# Altium project ESP32_Dev_Board.PrjPcb
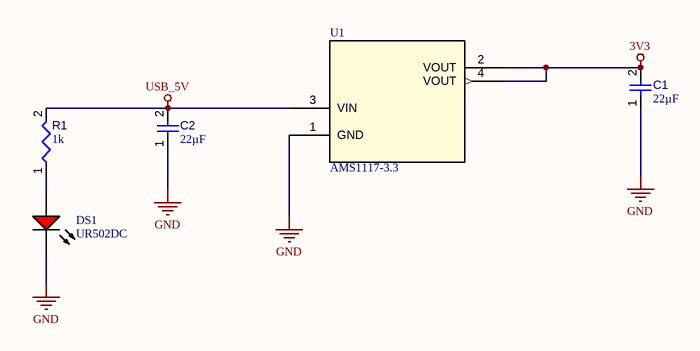
[diagram p0: 5V-to-3.3V_Voltage _Regulator.SchDoc]
4 sheets, 34 parts. Net scope: global (net labels, ports and power ports of the same name join across sheets).
Board file: ESP32_Dev_Board.PcbDoc
Sheets:
  5V-to-3.3V_Voltage _Regulator.SchDoc
  Micro_USB_&_USB-UART.SchDoc
  Connectors_&_Switch_Buttons.SchDoc
  ESP32_Module.SchDoc

## Sheet 5V-to-3.3V_Voltage _Regulator.SchDoc
size 431 x 279 mm; Organization: ORGANIZATION; Address1: ADDRESS 1; Address2: ADDRESS 2; Address3: ADDRESS 3; Address4: ADDRESS 4; Revision: -; SheetNumber: 1; SheetTotal: 4; ENG_APP_DATE: --/--/--; DSN_APP_DATE: --/--/--; CHK_APP_DATE: --/--/--

### Parts
C1  value 22µF  [CAPC0805(2012)145_L]  (hidden comment: Capacitor 22µF +/-40% 16V 0805)
C2  value 22µF  [CAPC0805(2012)145_L]  (hidden comment: Capacitor 22µF +/-40% 16V 0805)
DS1  UR502DC  [CGX-UR502DC]
R1  value 1k  [RESC0805(2012)_L]  (hidden comment: Resistor 1K +/-5% 0805 125 mW)
U1  AMS1117-3.3  [SOT-223_UMW]

### Nets
3V3: C1.2 U1.2(VOUT) U1.4(VOUT)
GND: C1.1 C2.1 DS1.2(K) U1.1(GND)
USB_5V: C2.2 R1.2 U1.3(VIN)
NetDS1_1: DS1.1(A) R1.1

### Notes on the sheet
- DWG. NO.
- REV.
- SHT.
- THIS DOCUMENT AND THE DATA DISCLOSED HEREIN OR HEREWITH IS THE PROPERTY OF ALTIUM LIMITED AND MAY BE FREELY DISTRIBUTED IN WHOLE. NO RIGHTS ARE RESERVED OR EXPRESS OR IMPLIED WARANTEE GIVEN.
- REVISION
- DESCRIPTION
- DATE
- APPROVED
- ENG:
- DSN:
- APPROVALS
- PROJECT REVISION:
- www.altium.com <http://www.altium.com>
- DOCUMENT REVISION:
- 92037, La Jolla
- USA
- Altium Ltd.
- 4225 Executive Square
- CHK:
- REFERENCE DOCUMENTS
- DESIGN ITEM:
- TITLE
- VARIANT
- BOM:
- FAB DWG:
- PCB DWG:
- ASSY DWG:
- SCALE:
- SIZE
- B
- CAGE CODE
- FILE NAME
- DWG NO.
- SHEET
- OF
- REV

### Library data of the parts
C1 C2 = CMP-001-00081-4: Chip Capacitor, 22µF +/-40%, 16V, 0805, Thickness 1.45 mm; Tolerance: 5%; Voltage Rating: 16V; Mounting Technology: SMT; Pins: 2; Max Operating Temperature: 85°C; Case/Package: 0805; Min Operating Temperature: -55°C
DS1 = CMP-007-00009-2: Red LED, 80 mW, 30 mA, -25 to 85 degC, 2-Pin THD; Manufacturer: Shenzhen CGX; Power: 80mW; Case/Package: UR502DC; RoHS Compliant: Unknown; Package Description: 2-Pin Through Hole Device, Dia 5.9 mm, Height 9.1 mm; Manufacturer URL: http://szcgx.com/; Datasheet Version: Sep-14; Package Reference: UR502DC; Datasheet URL: http://datasheet.octopart.com/UR502DC-Chengguangxing-datasheet-62330342.pdf; Mounting Technology: TH
R1 = CMP-009-00118-3: Chip Resistor, 1 kOhms, +/-5%, 125 mW, -55 to 155 degC, 0805; Tolerance: 5%; Power: 125mW; Case/Package: 0805; Pins: 2; Min Operating Temperature: -55°C; Max Operating Temperature: 155°C
U1 = AMS1117-3.3: Description; Manufacturer_Name: UMW(Youtai Semiconductor Co., Ltd.); Copyright: Copyright (C) 2026 Ultra Librarian. All rights reserved.; Manufacturer_Part_Number: AMS1117-3.3; RefDes: RefDes; Type: Type

## Sheet Micro_USB_&_USB-UART.SchDoc
size 431 x 279 mm; Organization: ORGANIZATION; Address1: ADDRESS 1; Address2: ADDRESS 2; Address3: ADDRESS 3; Address4: ADDRESS 4; Revision: -; SheetNumber: 2; SheetTotal: 4; ENG_APP_DATE: --/--/--; DSN_APP_DATE: --/--/--; CHK_APP_DATE: --/--/--
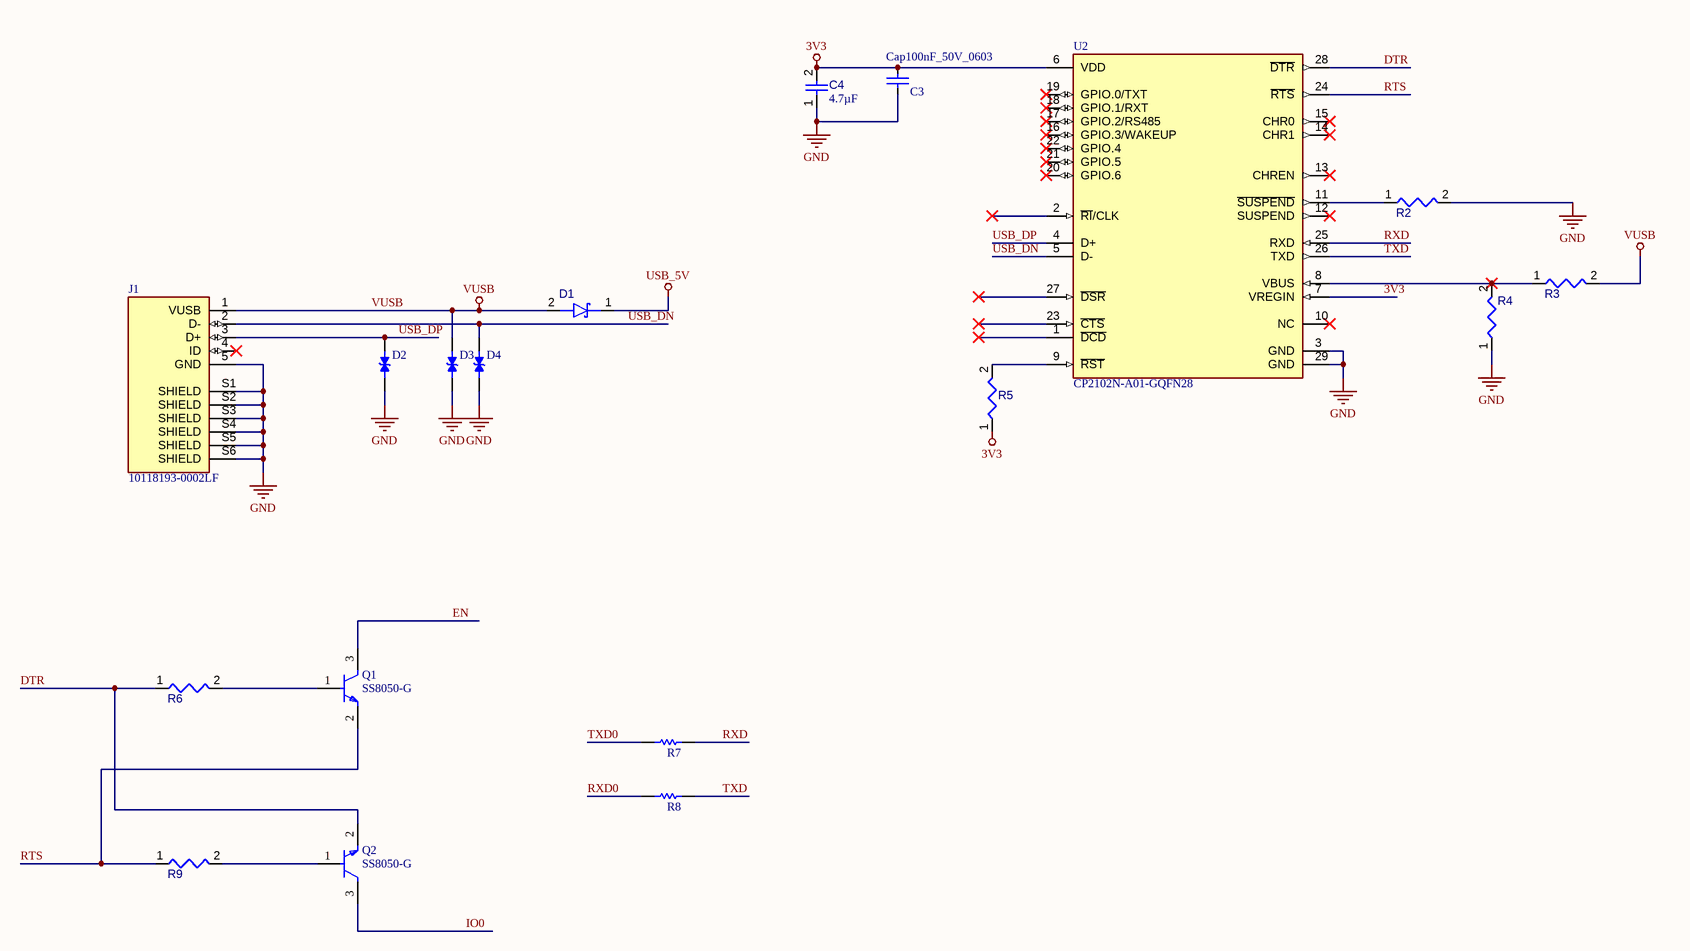
[diagram p1: Micro_USB_&_USB-UART.SchDoc]

### Parts
C3  Cap100nF_50V_0603  [0603C_L]
C4  value 4.7µF  [CAPC0805(2012)145_L]  (hidden comment: Capacitor 4.7µF +/-40% 25V 0805)
D1  RB520CM-30  [ROHM-VMN2-2_V]  (value not drawn)
D2  LESD5D5.0CT1G  [TVS_LESD5D5.0CT1G]  (value not drawn)
D3  LESD5D5.0CT1G  [TVS_LESD5D5.0CT1G]  (value not drawn)
D4  LESD5D5.0CT1G  [TVS_LESD5D5.0CT1G]  (value not drawn)
J1  10118193-0002LF  [AMPHENOL_10118193-0002LF]
Q1  SS8050-G  [FP-SS8050-G-MFG]
Q2  SS8050-G  [FP-SS8050-G-MFG]
R2  Resistor 10K  +/-1 % 0402 63 mW  [RESC0402(1005)_L]  (value not drawn)
R3  MFR-25FBF52-22K1  [RESA60-630X240]  (value not drawn)
R4  Resistor 47K5 +/-1 % 0402 63 mW  [RESC0402(1005)_L]  (value not drawn)
R5  Resistor 2K +/-5 % 0402 63 mW  [RESC0402(1005)_L]  (value not drawn)
R6  Resistor 10K  +/-1 % 0402 63 mW  [RESC0402(1005)_L]  (value not drawn)
R7  Resistor 0R +/- 5% 1206 250 mW  [RESC3216X60X45ML15T20]  (value not drawn)
R8  Resistor 0R +/- 5% 1206 250 mW  [RESC3216X60X45ML15T20]  (value not drawn)
R9  Resistor 10k +/-1% 0805 125 mW  [RESC2013X50X35ML15T15]  (value not drawn)
U2  CP2102N-A01-GQFN28  [FP-CP2102N-A01-GQFN28-MFG]

### Nets
3V3: C3.1 C4.2 R5.1 U2.6(VDD) U2.7(VREGIN)
GND: C3.2 C4.1 D2.1 D3.1 D4.1 J1.5(GND) J1.S1(SHIELD) J1.S2(SHIELD) J1.S3(SHIELD) J1.S4(SHIELD) J1.S5(SHIELD) J1.S6(SHIELD) R2.2 R4.1 U2.3(GND) U2.29(GND)
USB_5V: D1.1(K)
VUSB: D1.2(A) D3.2 J1.1(VUSB) R3.2
DTR: Q2.2(E) R6.1 U2.28(~{DTR})
EN: Q1.3(C)
IO0: Q2.3(C)
RTS: Q1.2(E) R9.1 U2.24(~{RTS})
RXD: R7.2 U2.25(RXD)
RXD0: R8.1
TXD: R8.2 U2.26(TXD)
TXD0: R7.1
USB_DN: D4.2 J1.2(D-) U2.5(D-)
USB_DP: D2.2 J1.3(D+) U2.4(D+)
NetQ1_1: Q1.1(B) R6.2
NetQ2_1: Q2.1(B) R9.2
NetR2_1: R2.1 U2.11(~{SUSPEND})
NetR3_1: R3.1 R4.2 U2.8(VBUS)
NetR5_2: R5.2 U2.9(~{RST})

Not connected (* = marked no-connect by the designer): J1 4(ID)*; U2 1(~{DCD})* 2(~{RI}/CLK)* 10(NC)* 12(SUSPEND)* 13(CHREN)* 14(CHR1)* 15(CHR0)* 16(GPIO.3/WAKEUP)* 17(GPIO.2/RS485)* 18(GPIO.1/RXT)* 19(GPIO.0/TXT)* 20(GPIO.6)* 21(GPIO.5)* 22(GPIO.4)* 23(~{CTS})* 27(~{DSR})*

### Notes on the sheet
- DWG. NO.
- REV.
- SHT.
- THIS DOCUMENT AND THE DATA DISCLOSED HEREIN OR HEREWITH IS THE PROPERTY OF ALTIUM LIMITED AND MAY BE FREELY DISTRIBUTED IN WHOLE. NO RIGHTS ARE RESERVED OR EXPRESS OR IMPLIED WARANTEE GIVEN.
- REVISION
- DESCRIPTION
- DATE
- APPROVED
- ENG:
- DSN:
- APPROVALS
- PROJECT REVISION:
- www.altium.com <http://www.altium.com>
- DOCUMENT REVISION:
- 92037, La Jolla
- USA
- Altium Ltd.
- 4225 Executive Square
- CHK:
- REFERENCE DOCUMENTS
- DESIGN ITEM:
- TITLE
- VARIANT
- BOM:
- FAB DWG:
- PCB DWG:
- ASSY DWG:
- SCALE:
- SIZE
- B
- CAGE CODE
- FILE NAME
- DWG NO.
- SHEET
- OF
- REV

### Library data of the parts
C3 = CMP-001-00084-1: Ceramic Capacitor, Multilayer, Ceramic, 50V, 80% +Tol, 20% -Tol, Y5V, -82/+22% TC, 0.1uF, Surface Mount, 0603; Manufacturer: Yageo; Manufacturer Part Number: CC0603ZRY5V9BB104; Value: 100nF; Multilayer: Yes; Mounting Technology: Surface Mount; Case/Package: 0603; Pins: 2; RoHS Compliant: Yes; Min Operating Temperature: -30°C; Max Operating Temperature: 85°C; Capacitor Type: Ceramic; Voltage Rating: 50V; Component Type: Capacitors; Source: WCT.SCHLIB; Design Item ID: Cap100nF_50V_0603; Tolerance (fill in as +-): 80%; Packaging: Tape and Reel; Termination: Wraparound; Height: 0.8mm; Reach SVHC Compliant: Yes; Rated DC Voltage (URdc): 50V; Package Style: SMTMeter; Tolerance  (fill in as +-): 20%; Length: 1.6mm; JESD-609 Code: e3; Terminal Finish: Nickel; Dielectric Material: Ceramic; Temperature Characteristics Code: Y5V; Package Shape: Rectangular; Width: 0.8mm
C4 = CMP-001-00080-4: Chip Capacitor, 4.7µF +/-40%, 25V, 0805, Thickness 1.45 mm; Tolerance: 20%; Voltage Rating: 25V; Min Operating Temperature: -55°C; Max Operating Temperature: 85°C; Pins: 2; Mounting Technology: SMT; Case/Package: 0805
D1 = CMP-004-00028-3: DIODE SCHOTTKY 30V 100MA VMN2M; Case/Package: SMD/SMT; Pins: 2; Mounting Technology: SMT
D2-D4 = LESD5D5.0CT1G: Transient Voltage Suppressors for ESD Protection; MF: Leshan Radio Co.; Check_prices: https://www.snapeda.com/parts/LESD5D5.0CT1G/Leshan+Radio+Co./view-part/?ref=eda; Value: *; Availability: Not in stock; Package: None; SnapEDA_Link: https://www.snapeda.com/parts/LESD5D5.0CT1G/Leshan+Radio+Co./view-part/?ref=snap; MP: LESD5D5.0CT1G; Price: None
J1 = 10118193-0002LF: Micro USB 2.0, Input Output Connectors, B TYPE RECEPTACLE with flange; MF: Amphenol ICC (FCI); SnapEDA_Link: https://www.snapeda.com/parts/10118193-0002LF/Amphenol+FCI/view-part/?ref=snap; Package: None; Value: *; MP: 10118193-0002LF; Check_prices: https://www.snapeda.com/parts/10118193-0002LF/Amphenol+FCI/view-part/?ref=eda
Q1 Q2 = CMP-20235-000001-1: NPN TRANSISTOR 1.5A 40V SOT-23 R; Transition Frequency: 100MHz; Max Breakdown Voltage: 25V; Collector Emitter Voltage (VCEO): 400mV; Max Power Dissipation: 300mW; Max Collector Current: 1.5A; Case/Package: TO-236-3; Packaging: Tape and Reel; RoHS Compliant: Yes; Mount: Surface Mount; Collector Emitter Breakdown Voltage: 25V
R2 = CMP-009-00149-3: Chip Resistor, 10 kOhms, +/-1 %, 63 mW, -55 to 125 degC, 0402; Tolerance: 1%; Power: 63mW; Case/Package: 0402; Pins: 2; Min Operating Temperature: -55°C; Max Operating Temperature: 155°C; Value: 10k
R3 = CMP-009-00052-4: Axial Resistor, 22.1 KOhm, +/- 1%, 0.25 W, -55 to 155 degC, 2-Pin THD, RoHS, Bulk; Manufacturer: Yageo; Power: 250mW; Voltage Rating: 250V; Value: 22.1k; Mounting Technology: TH; Case/Package: Axial; RoHS Compliant: True; Min Operating Temperature: -55°C; Max Operating Temperature: 155°C; Tolerance: 1%; Packaging: Bulk; Package Quantity: 200; Package Reference: MFR-25; Manufacturer URL: http://www.yageo.com/; Package Description: 2-Pin Axial Lead, Dia 2.4 mm, Body Length 6.3 mm; Datasheet Version: Apr-13; Datasheet URL: http://www.yageo.com/documents/recent/Yageo%20LR_MFR_2013.pdf
R4 = CMP-009-00137-3: Chip Resistor, 47,5 kOhms, +/-1 %, 63 mW, -55 to 155 degC, 0402; Tolerance: 1%; Power: 63mW; Value: 47.5k; Case/Package: 0402; Pins: 2; Min Operating Temperature: -55°C; Max Operating Temperature: 155°C
R5 = CMP-009-00138-3: Chip Resistor, 2 kOhms, +/-5 %, 63 mW, -55 to 155 degC, 0402; Tolerance: 5%; Power: 63mW; Case/Package: 0402; Pins: 2; Min Operating Temperature: -55°C; Max Operating Temperature: 155°C; Value: 2k
R6 = CMP-009-00149-3: Chip Resistor, 10 kOhms, +/-5 %, 63 mW, -55 to 125 degC, 0402; Tolerance: 1%; Power: 63mW; Case/Package: 0402; Pins: 2; Min Operating Temperature: -55°C; Max Operating Temperature: 155°C; Value: 10k
R7 R8 = CMP-009-00002-5: Chip Resistor, 0 Ohm, +/- 5%, 0.25 W, -55 to 155 degC, 1206 (3216 Metric); Power: 250mW; Voltage Rating: 200V; Value: 0; Mounting Technology: SM; Case/Package: 1206; Pins: 2; RoHS Compliant: True; Min Operating Temperature: -55°C; Max Operating Temperature: 155°C; Tolerance: 5%
R9 = CMP-009-00018-5: Chip Resistor, 10 KOhm, +/- 5%, 125 mW, -55 to 155 degC, 0805 (2012 Metric); Tolerance: 1%; Power: 125mW; Voltage Rating: 150V; Mounting Technology: SM; Case/Package: 0805; Pins: 2; RoHS Compliant: True; Min Operating Temperature: -55°C; Max Operating Temperature: 155°C; Value: 10k
U2 = CMP-08093-000004-1: IC BRIDGE USB TO UART 28QFN; Manufacturer: Silicon Labs; Standoff Height: 0mm; Max Junction Temp: +105°C; Usb Standard: USB 2.0; Number Of Ports: 1; Nominal Supply Current: 195-13700uA; Min Supply Voltage: 1.71V; Max Supply Voltage: 5.25V; Interface: UART,USB,RS-232,RS-485; Height: 0.8mm; Package: CP2102N-A01-GQFN28; Temperature Range Low: -40°C; Lead Free: Yes; Category: IC; Ambient Temperature Range High: +85°C; Device Class L3: USB Interface ICs; Octopart: https://octopart.com/cp2102n-a01-gqfn28-silicon+labs-74636024; Manufacturer Part Number: CP2102N-A01-GQFN28; Device Class L2: Interface ICs; ComponentLink2URL: https://media.digikey.com/pdf/Data%20Sheets/Silicon%20Laboratories%20PDFs/CP2102N_Rev.1.3_DS.pdf; Automotive: No; Temperature: -40°C to +85°C; Device Class L1: Integrated Circuits (ICs); Mouser Description: IC BRIDGE USB TO UART 28QFN; RoHS: TRUE; Ambient Temperature Range Low: -40°C; Temperature Range High: +85°C; Ipc Land Pattern Name: QFN50P500X500X75-28; Digikey Description: IC BRIDGE USB TO UART 28QFN; ComponentLink2Description: Datasheet

## Sheet Connectors_&_Switch_Buttons.SchDoc
size 431 x 279 mm; Organization: ORGANIZATION; Address1: ADDRESS 1; Address2: ADDRESS 2; Address3: ADDRESS 3; Address4: ADDRESS 4; Revision: -; SheetNumber: 3; SheetTotal: 4; ENG_APP_DATE: --/--/--; DSN_APP_DATE: --/--/--; CHK_APP_DATE: --/--/--
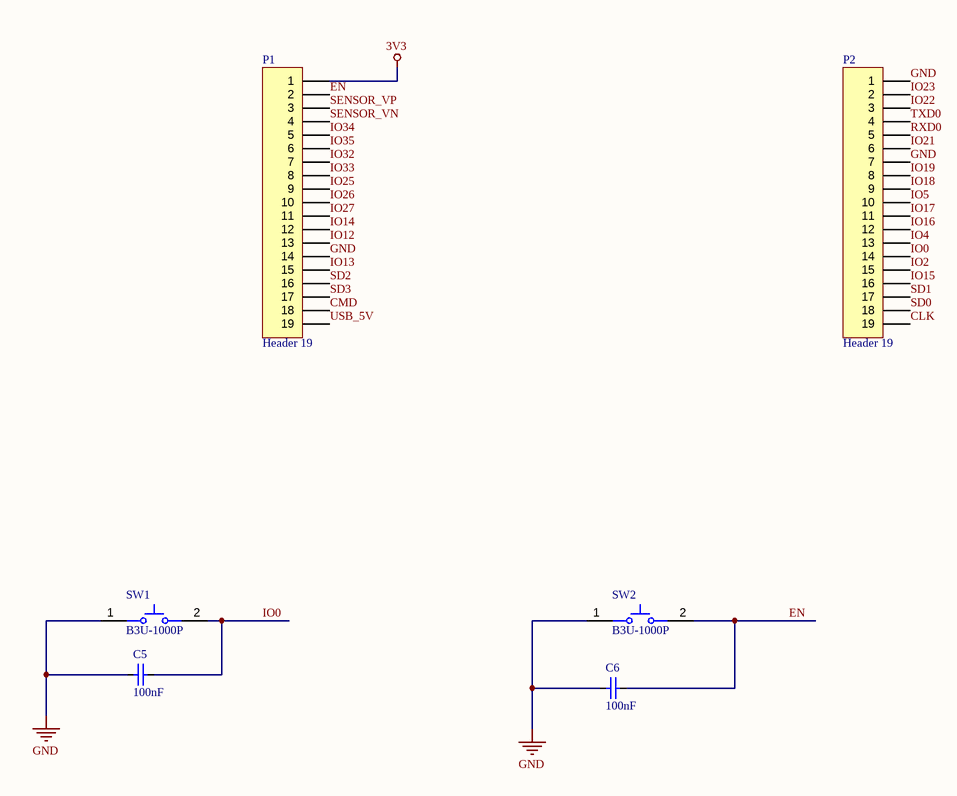
[diagram p2: Connectors_&_Switch_Buttons.SchDoc]

### Parts
C5  value 100nF  [0603C_L]  (hidden comment: Cap100nF_50V_0603)
C6  value 100nF  [0603C_L]  (hidden comment: Cap100nF_50V_0603)
P1  Header 19  [HDR1X19]
P2  Header 19  [HDR1X19]
SW1  B3U-1000P  [OMRON-B3U-1000_V]
SW2  B3U-1000P  [OMRON-B3U-1000_V]

### Nets
3V3: P1.1
GND: C5.1 C6.1 P1.14 P2.1 P2.7 SW1.1 SW2.1
USB_5V: P1.19
CLK: P2.19
CMD: P1.18
EN: C6.2 P1.2 SW2.2
IO0: C5.2 P2.14 SW1.2
IO2: P2.15
IO4: P2.13
IO5: P2.10
IO12: P1.13
IO13: P1.15
IO14: P1.12
IO15: P2.16
IO16: P2.12
IO17: P2.11
IO18: P2.9
IO19: P2.8
IO21: P2.6
IO22: P2.3
IO23: P2.2
IO25: P1.9
IO26: P1.10
IO27: P1.11
IO32: P1.7
IO33: P1.8
IO34: P1.5
IO35: P1.6
RXD0: P2.5
SD0: P2.18
SD1: P2.17
SD2: P1.16
SD3: P1.17
SENSOR_VN: P1.4
SENSOR_VP: P1.3
TXD0: P2.4

### Notes on the sheet
- DWG. NO.
- REV.
- SHT.
- THIS DOCUMENT AND THE DATA DISCLOSED HEREIN OR HEREWITH IS THE PROPERTY OF ALTIUM LIMITED AND MAY BE FREELY DISTRIBUTED IN WHOLE. NO RIGHTS ARE RESERVED OR EXPRESS OR IMPLIED WARANTEE GIVEN.
- REVISION
- DESCRIPTION
- DATE
- APPROVED
- ENG:
- DSN:
- APPROVALS
- PROJECT REVISION:
- www.altium.com <http://www.altium.com>
- DOCUMENT REVISION:
- 92037, La Jolla
- USA
- Altium Ltd.
- 4225 Executive Square
- CHK:
- REFERENCE DOCUMENTS
- DESIGN ITEM:
- TITLE
- VARIANT
- BOM:
- FAB DWG:
- PCB DWG:
- ASSY DWG:
- SCALE:
- SIZE
- B
- CAGE CODE
- FILE NAME
- DWG NO.
- SHEET
- OF
- REV

### Library data of the parts
C5 C6 = CMP-001-00084-1: Ceramic Capacitor, Multilayer, Ceramic, 50V, 80% +Tol, 20% -Tol, Y5V, -82/+22% TC, 0.1uF, Surface Mount, 0603; Manufacturer: Yageo; Manufacturer Part Number: CC0603ZRY5V9BB104; Multilayer: Yes; Source: WCT.SCHLIB; Voltage Rating: 50V; Design Item ID: Cap100nF_50V_0603; Tolerance (fill in as +-): 80%; Packaging: Tape and Reel; Mounting Technology: Surface Mount; Pins: 2; Termination: Wraparound; Capacitor Type: Ceramic; Height: 0.8mm; Reach SVHC Compliant: Yes; Rated DC Voltage (URdc): 50V; RoHS Compliant: Yes; Package Style: SMTMeter; Tolerance  (fill in as +-): 20%; Length: 1.6mm; Case/Package: 0603; JESD-609 Code: e3; Component Type: Capacitors; Terminal Finish: Nickel; Max Operating Temperature: 85°C; Min Operating Temperature: -30°C; Dielectric Material: Ceramic; Temperature Characteristics Code: Y5V; Package Shape: Rectangular; Width: 0.8mm
P1 P2 = Header 19: Header, 19-Pin; LatestRevisionDate: 17-Jul-2002; LatestRevisionNote: Re-released for DXP Platform.; Publisher: Altium Limited
SW1 SW2 = CMP-011-00000-2: Tactile Switch, SPST-NO, 0.05 A, 12 V, -25 to 70 degC, 2-Pin SMD, RoHS, Tape and Reel; Manufacturer: Omron Electronic Components; IP Rating: IP40; Current Rating: 50mA; Max Contact Resistance: 100mohm; Operating Force: 153gf; Throw Configuration: SPST; Resistance: 0.1Ohm; Max Voltage Rating (DC): 12V; Contact Material: Silver; Max Current Rating: 50mA; Datasheet URL: http://www.omron.com/ecb/products/pdf/en-b3u.pdf; Mounting Technology: SM; Case/Package: B3U-1000; Packaging: TapeandReel; Package Reference: B3U-1000; Manufacturer URL: http://www.omron.com/; Datasheet Version: Jan-15; RoHS Compliant: True; Max Operating Temperature: 70°C; Contact Current Rating: 50mA; Package Quantity: 3500; Package Description: 2-Pin Surface Mount Device, Body 3 x 2.5 mm; Voltage Rating (DC): 12V; Min Operating Temperature: -25°C; Voltage Rating: 12V

## Sheet ESP32_Module.SchDoc
size 431 x 279 mm; Organization: ORGANIZATION; Address1: ADDRESS 1; Address2: ADDRESS 2; Address3: ADDRESS 3; Address4: ADDRESS 4; Revision: -; SheetNumber: 4; SheetTotal: 4; ENG_APP_DATE: --/--/--; DSN_APP_DATE: --/--/--; CHK_APP_DATE: --/--/--
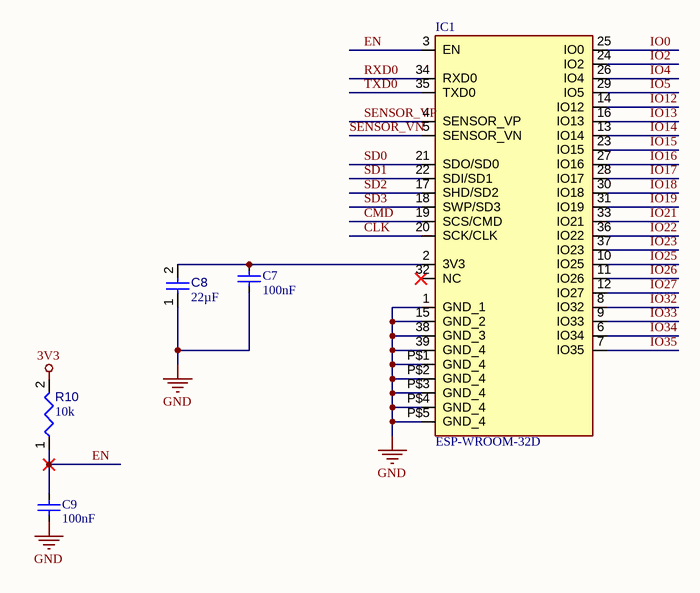
[diagram p3: ESP32_Module.SchDoc]

### Parts
C7  value 100nF  [0603C_L]  (hidden comment: Cap100nF_50V_0603)
C8  value 22µF  [CAPC0805(2012)145_L]  (hidden comment: Capacitor 22µF +/-40% 16V 0805)
C9  value 100nF  [0603C_L]  (hidden comment: Cap100nF_50V_0603)
IC1  ESP-WROOM-32D  [ESPWROOM32D]
R10  value 10k  [RESC0402(1005)_L]  (hidden comment: Resistor 10K  +/-1 % 0402 63 mW)

### Nets
3V3: R10.2
GND: C7.1 C8.1 C9.1 IC1.1(GND_1) IC1.15(GND_2) IC1.38(GND_3) IC1.39(GND_4) IC1.P$1(GND_4) IC1.P$2(GND_4) IC1.P$3(GND_4) IC1.P$4(GND_4) IC1.P$5(GND_4)
CLK: IC1.20(SCK/CLK)
CMD: IC1.19(SCS/CMD)
EN: C9.2 IC1.3(EN) R10.1
IO0: IC1.25(IO0)
IO2: IC1.24(IO2)
IO4: IC1.26(IO4)
IO5: IC1.29(IO5)
IO12: IC1.14(IO12)
IO13: IC1.16(IO13)
IO14: IC1.13(IO14)
IO15: IC1.23(IO15)
IO16: IC1.27(IO16)
IO17: IC1.28(IO17)
IO18: IC1.30(IO18)
IO19: IC1.31(IO19)
IO21: IC1.33(IO21)
IO22: IC1.36(IO22)
IO23: IC1.37(IO23)
IO25: IC1.10(IO25)
IO26: IC1.11(IO26)
IO27: IC1.12(IO27)
IO32: IC1.8(IO32)
IO33: IC1.9(IO33)
IO34: IC1.6(IO34)
IO35: IC1.7(IO35)
RXD0: IC1.34(RXD0)
SD0: IC1.21(SDO/SD0)
SD1: IC1.22(SDI/SD1)
SD2: IC1.17(SHD/SD2)
SD3: IC1.18(SWP/SD3)
SENSOR_VN: IC1.5(SENSOR_VN)
SENSOR_VP: IC1.4(SENSOR_VP)
TXD0: IC1.35(TXD0)
NetC7_2: C7.2 C8.2 IC1.2(3V3)

Not connected (* = marked no-connect by the designer): IC1 32(NC)*

### Notes on the sheet
- DWG. NO.
- REV.
- SHT.
- THIS DOCUMENT AND THE DATA DISCLOSED HEREIN OR HEREWITH IS THE PROPERTY OF ALTIUM LIMITED AND MAY BE FREELY DISTRIBUTED IN WHOLE. NO RIGHTS ARE RESERVED OR EXPRESS OR IMPLIED WARANTEE GIVEN.
- REVISION
- DESCRIPTION
- DATE
- APPROVED
- ENG:
- DSN:
- APPROVALS
- PROJECT REVISION:
- www.altium.com <http://www.altium.com>
- DOCUMENT REVISION:
- 92037, La Jolla
- USA
- Altium Ltd.
- 4225 Executive Square
- CHK:
- REFERENCE DOCUMENTS
- DESIGN ITEM:
- TITLE
- VARIANT
- BOM:
- FAB DWG:
- PCB DWG:
- ASSY DWG:
- SCALE:
- SIZE
- B
- CAGE CODE
- FILE NAME
- DWG NO.
- SHEET
- OF
- REV

### Library data of the parts
C7 C9 = CMP-001-00084-1: as C5 on sheet Connectors_&_Switch_Buttons; Source: WCT.SCHLIB; Voltage Rating: 50V; Design Item ID: Cap100nF_50V_0603; Tolerance (fill in as +-): 80%; Packaging: Tape and Reel; Mounting Technology: Surface Mount; Pins: 2; Termination: Wraparound; Capacitor Type: Ceramic; Height: 0.8mm; Reach SVHC Compliant: Yes; Rated DC Voltage (URdc): 50V; RoHS Compliant: Yes; Package Style: SMTMeter; Tolerance  (fill in as +-): 20%; Length: 1.6mm; Case/Package: 0603; JESD-609 Code: e3; Component Type: Capacitors; Terminal Finish: Nickel; Max Operating Temperature: 85°C; Min Operating Temperature: -30°C; Dielectric Material: Ceramic; Temperature Characteristics Code: Y5V; Package Shape: Rectangular; Width: 0.8mm
C8 = CMP-001-00081-4: as C1 on sheet 5V-to-3.3V_Voltage _Regulator; Voltage Rating: 16V; Mounting Technology: SMT; Pins: 2; Max Operating Temperature: 85°C; Case/Package: 0805; Min Operating Temperature: -55°C
IC1 = ESP-WROOM-32D: WiFi / 802.11 Modules; MF: Espressif Systems; SnapEDA_Link: https://www.snapeda.com/parts/ESP-WROOM-32D/Espressif+Systems/view-part/?ref=snap; Package: None; Value: *; MP: ESP-WROOM-32D; Check_prices: https://www.snapeda.com/parts/ESP-WROOM-32D/Espressif+Systems/view-part/?ref=eda
R10 = CMP-009-00149-3: Chip Resistor, 10 kOhms, +/-1 %, 63 mW, -55 to 125 degC, 0402; Power: 63mW; Tolerance: 1%; Min Operating Temperature: -55°C; Case/Package: 0402; Max Operating Temperature: 155°C; Pins: 2

## Nets that join several sheets
3V3: 5V-to-3.3V_Voltage _Regulator (C1.2 U1.2 U1.4), Micro_USB_&_USB-UART (5 pins), Connectors_&_Switch_Buttons (P1.1), ESP32_Module (R10.2)
GND: 5V-to-3.3V_Voltage _Regulator (C1.1 C2.1 DS1.2 U1.1), Micro_USB_&_USB-UART (16 pins), Connectors_&_Switch_Buttons (7 pins), ESP32_Module (12 pins)
USB_5V: 5V-to-3.3V_Voltage _Regulator (C2.2 R1.2 U1.3), Micro_USB_&_USB-UART (D1.1), Connectors_&_Switch_Buttons (P1.19)
CLK: Connectors_&_Switch_Buttons (P2.19), ESP32_Module (IC1.20)
CMD: Connectors_&_Switch_Buttons (P1.18), ESP32_Module (IC1.19)
EN: Micro_USB_&_USB-UART (Q1.3), Connectors_&_Switch_Buttons (C6.2 P1.2 SW2.2), ESP32_Module (C9.2 IC1.3 R10.1)
IO0: Micro_USB_&_USB-UART (Q2.3), Connectors_&_Switch_Buttons (C5.2 P2.14 SW1.2), ESP32_Module (IC1.25)
IO2: Connectors_&_Switch_Buttons (P2.15), ESP32_Module (IC1.24)
IO4: Connectors_&_Switch_Buttons (P2.13), ESP32_Module (IC1.26)
IO5: Connectors_&_Switch_Buttons (P2.10), ESP32_Module (IC1.29)
IO12: Connectors_&_Switch_Buttons (P1.13), ESP32_Module (IC1.14)
IO13: Connectors_&_Switch_Buttons (P1.15), ESP32_Module (IC1.16)
IO14: Connectors_&_Switch_Buttons (P1.12), ESP32_Module (IC1.13)
IO15: Connectors_&_Switch_Buttons (P2.16), ESP32_Module (IC1.23)
IO16: Connectors_&_Switch_Buttons (P2.12), ESP32_Module (IC1.27)
IO17: Connectors_&_Switch_Buttons (P2.11), ESP32_Module (IC1.28)
IO18: Connectors_&_Switch_Buttons (P2.9), ESP32_Module (IC1.30)
IO19: Connectors_&_Switch_Buttons (P2.8), ESP32_Module (IC1.31)
IO21: Connectors_&_Switch_Buttons (P2.6), ESP32_Module (IC1.33)
IO22: Connectors_&_Switch_Buttons (P2.3), ESP32_Module (IC1.36)
IO23: Connectors_&_Switch_Buttons (P2.2), ESP32_Module (IC1.37)
IO25: Connectors_&_Switch_Buttons (P1.9), ESP32_Module (IC1.10)
IO26: Connectors_&_Switch_Buttons (P1.10), ESP32_Module (IC1.11)
IO27: Connectors_&_Switch_Buttons (P1.11), ESP32_Module (IC1.12)
IO32: Connectors_&_Switch_Buttons (P1.7), ESP32_Module (IC1.8)
IO33: Connectors_&_Switch_Buttons (P1.8), ESP32_Module (IC1.9)
IO34: Connectors_&_Switch_Buttons (P1.5), ESP32_Module (IC1.6)
IO35: Connectors_&_Switch_Buttons (P1.6), ESP32_Module (IC1.7)
RXD0: Micro_USB_&_USB-UART (R8.1), Connectors_&_Switch_Buttons (P2.5), ESP32_Module (IC1.34)
SD0: Connectors_&_Switch_Buttons (P2.18), ESP32_Module (IC1.21)
SD1: Connectors_&_Switch_Buttons (P2.17), ESP32_Module (IC1.22)
SD2: Connectors_&_Switch_Buttons (P1.16), ESP32_Module (IC1.17)
SD3: Connectors_&_Switch_Buttons (P1.17), ESP32_Module (IC1.18)
SENSOR_VN: Connectors_&_Switch_Buttons (P1.4), ESP32_Module (IC1.5)
SENSOR_VP: Connectors_&_Switch_Buttons (P1.3), ESP32_Module (IC1.4)
TXD0: Micro_USB_&_USB-UART (R7.1), Connectors_&_Switch_Buttons (P2.4), ESP32_Module (IC1.35)